# EasyEDA schematic GESTURE CAR.json

## Sheets
1 RECEIVING CIRCUIT: TITLE: RECEIVER CIRCUIT; REV: 1.0; Date: 11-03-2021; Sheet: 1/1
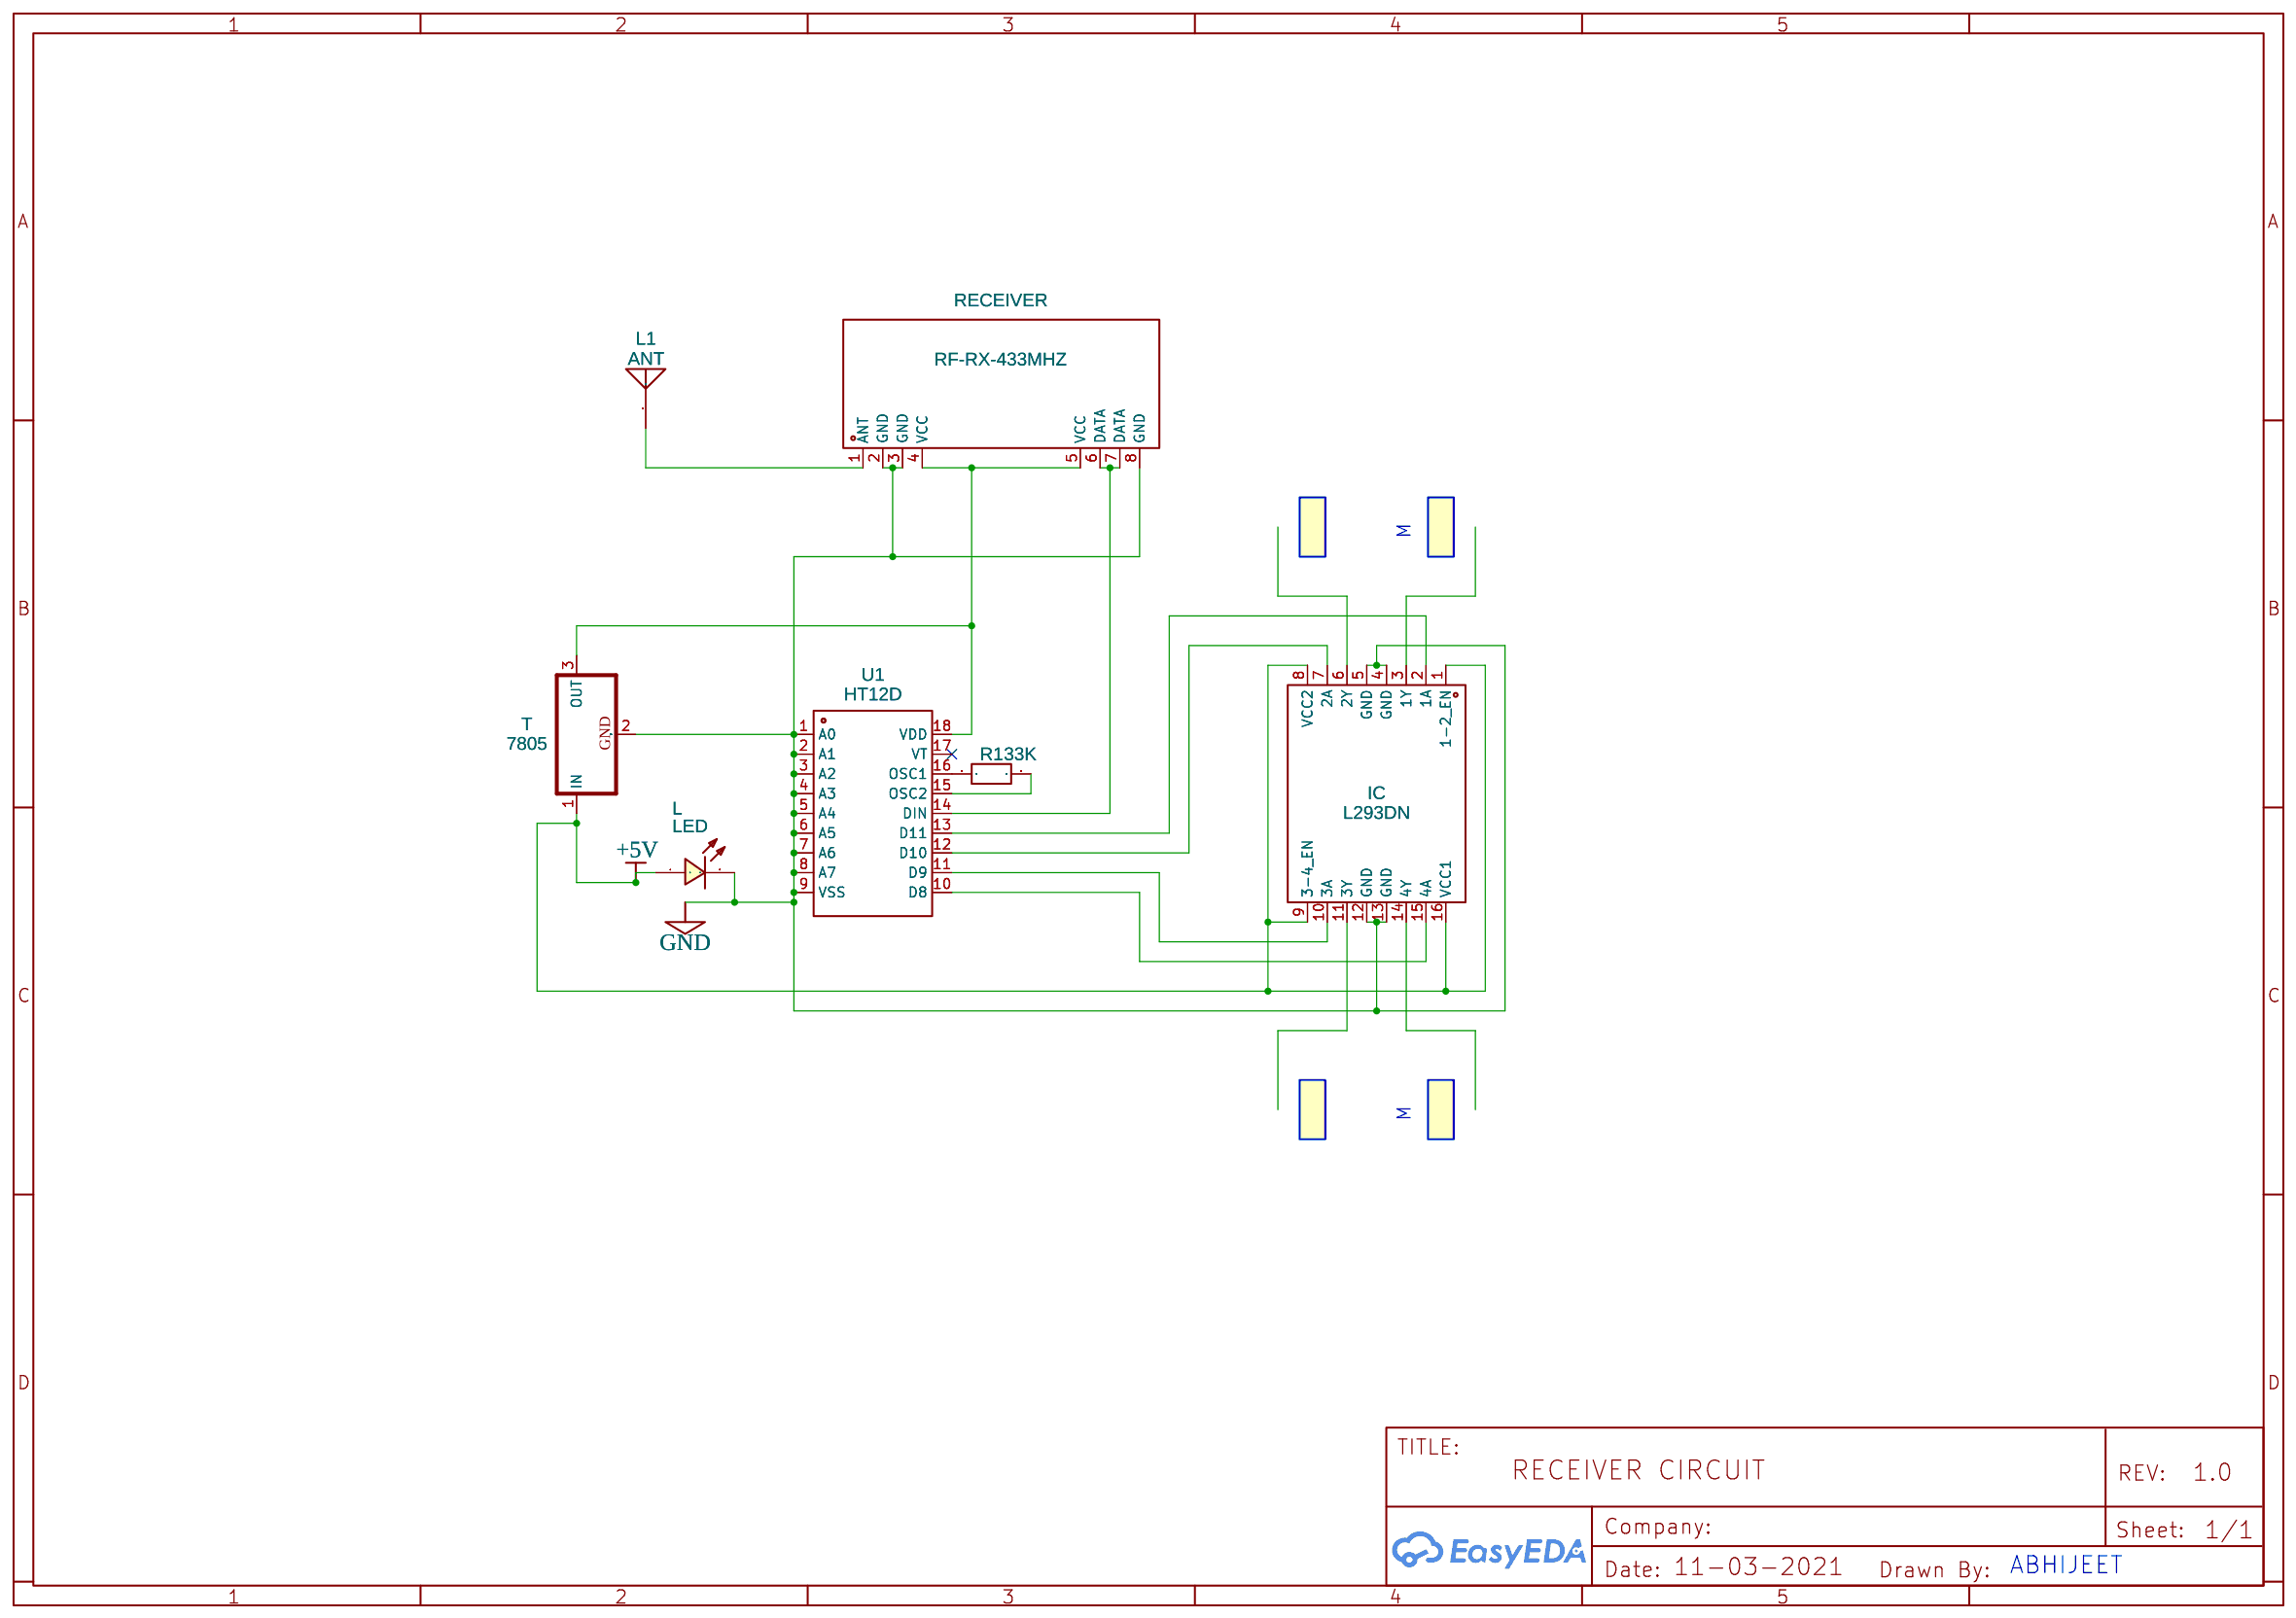
[diagram p0: RECEIVING CIRCUIT]
2 TRANSMITTER CIRCUIT: TITLE: TRANSMITTER CIRCUIT; Date: 27-03-2021
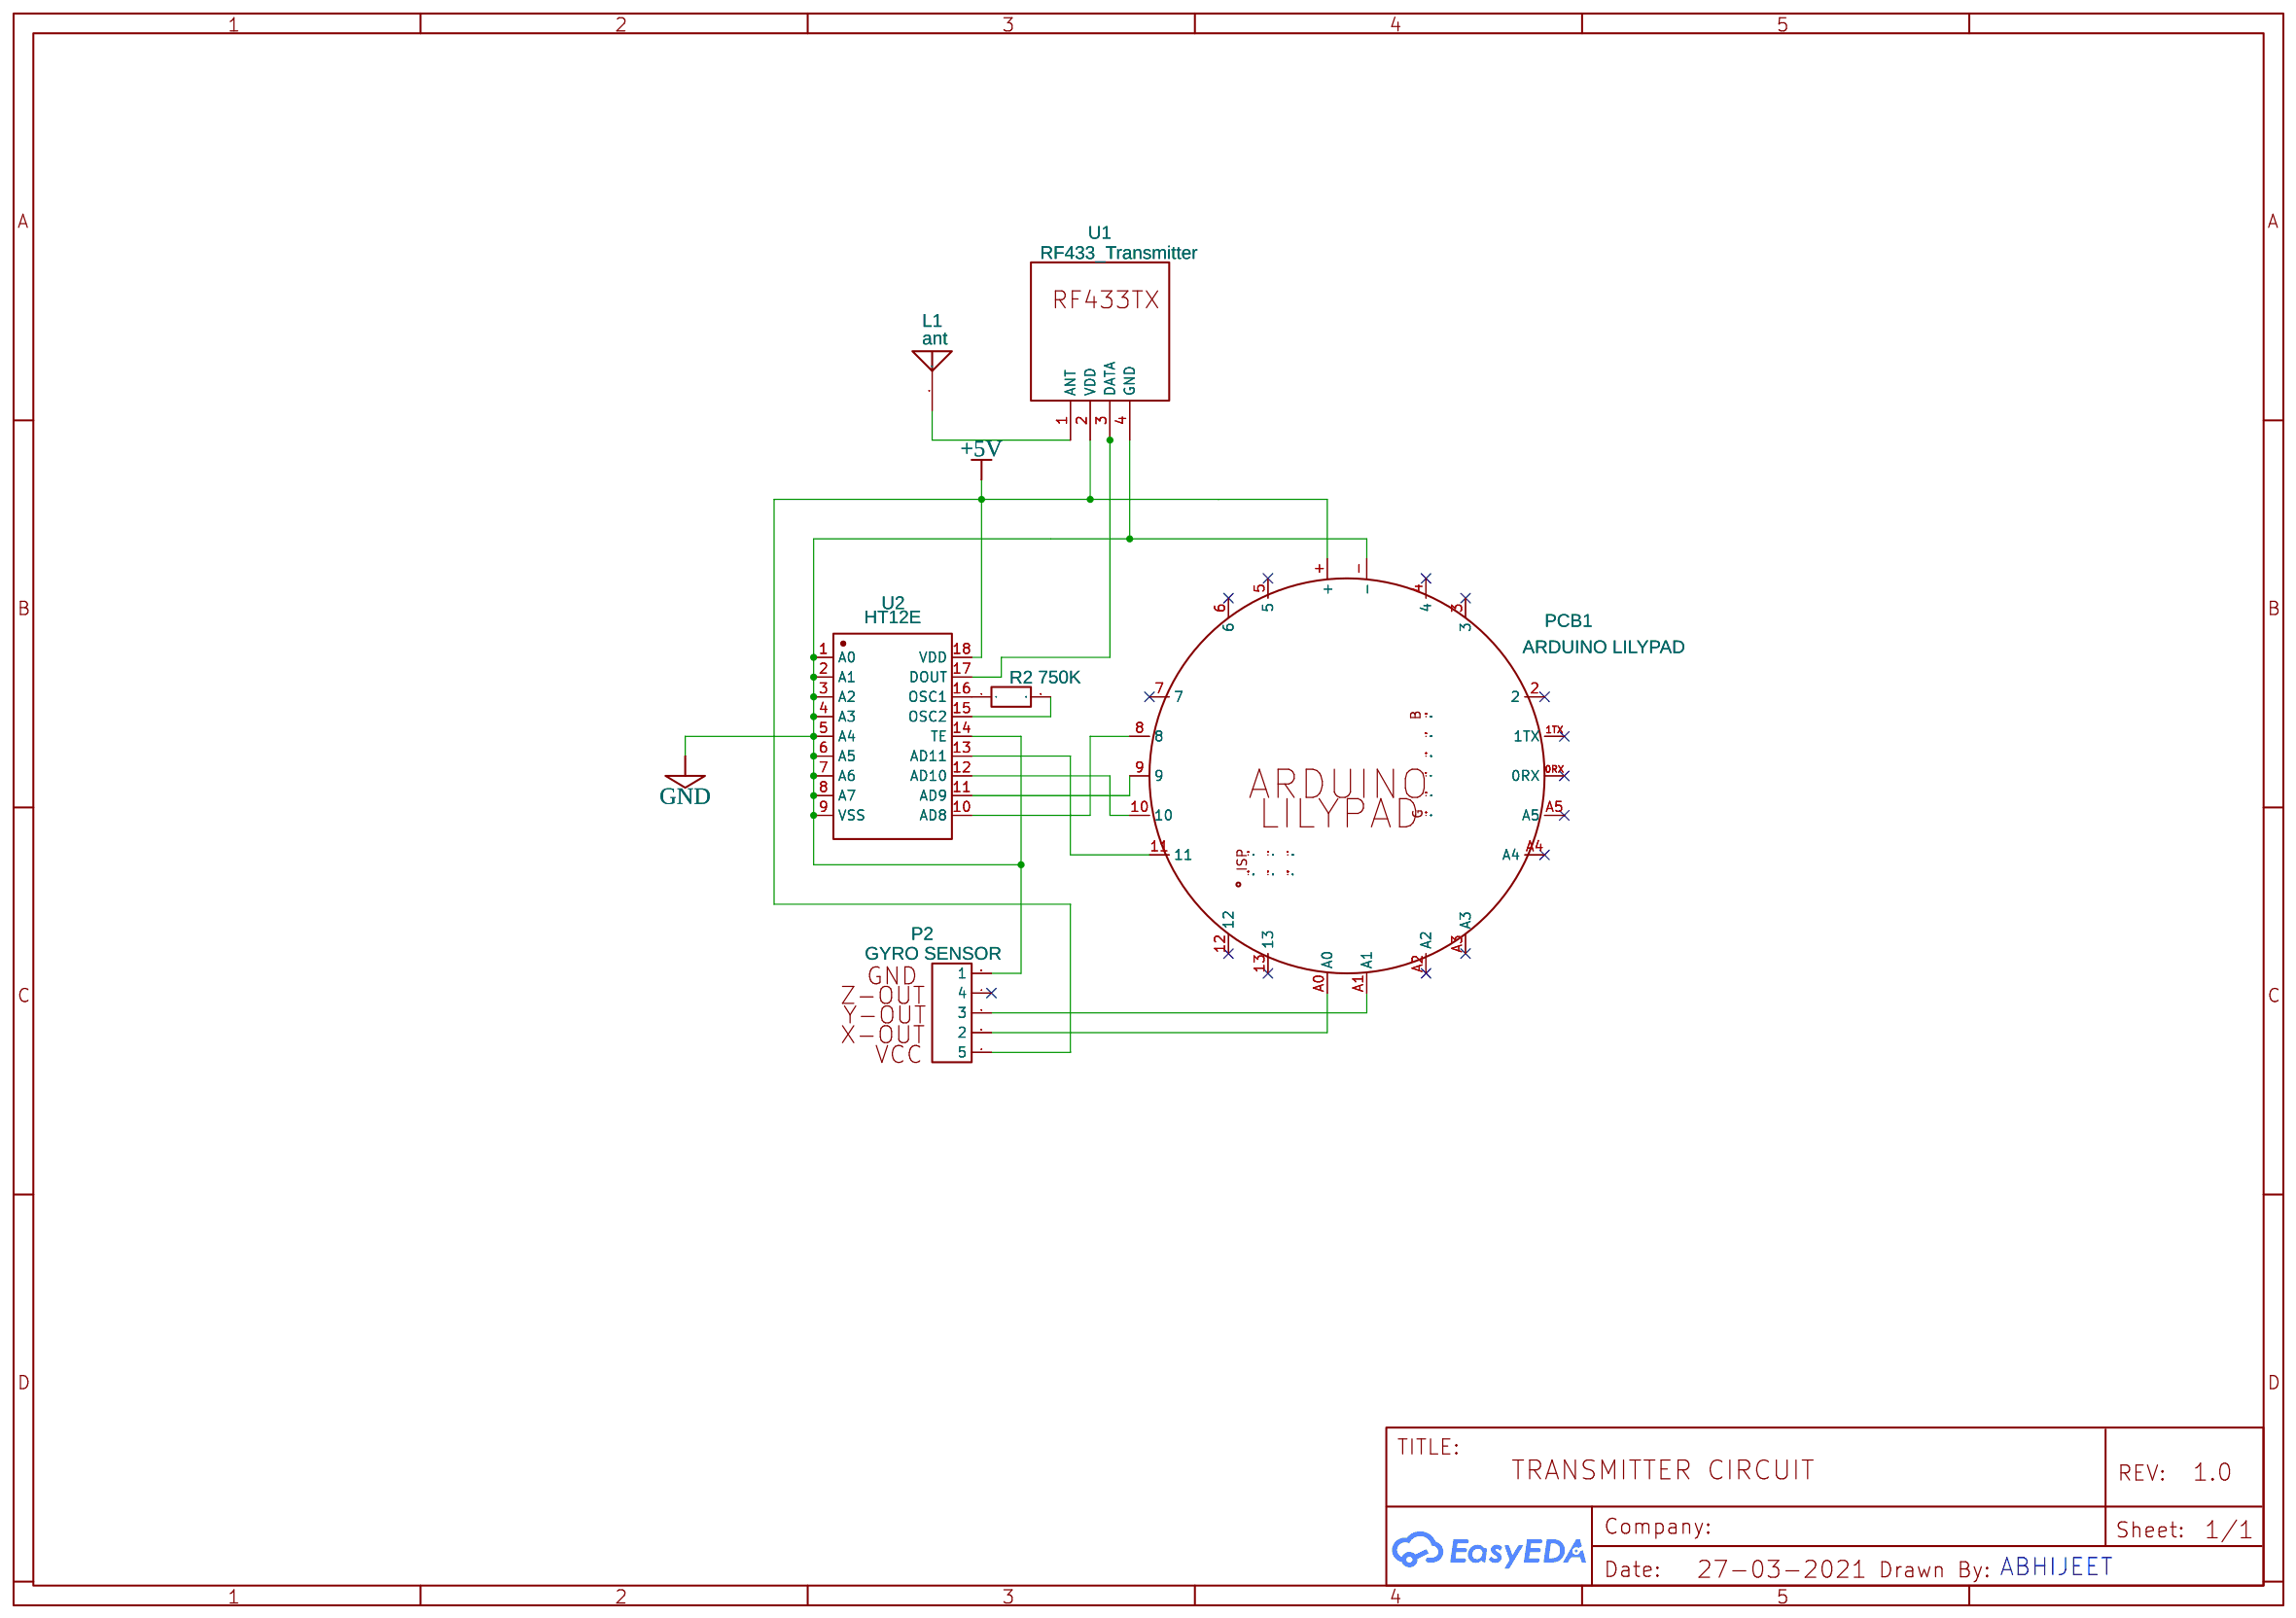
[diagram p1: TRANSMITTER CIRCUIT]

## Parts
sheet RECEIVING CIRCUIT
IC  L293DN  [DIP-16_L19.2-W6.6-P2.54-LS7.6-BL]
L  LED  [LED-TH_BD3.8-P2.54-FD]
L1  ANT  [ANT-TH_1P]
R1  33K  [RES-TH_BD2.4-L6.3-P10.30-D0.6]
RECEIVER  RF-RX-433MHZ  [WIRELM-TH_DL-RX98H-433M]
T  7805  [TO220H]
U1  HT12D  [DIP-18_L23.0-W6.5-P2.54-LS7.6-BL]
sheet TRANSMITTER CIRCUIT
L1#2  ant  [ANT-TH_1P]
P2  GYRO SENSOR  [HDR-5X1/2.54]
PCB1  ARDUINO LILYPAD  [ARDUINO_LILYPAD]
R2  750K  [RES-TH_BD2.4-L6.3-P10.30-D0.6]
U1#2  RF433_Transmitter  [RF_TRANSMITTER_433]
U2  HT12E  [DIP18]

## Library data of the parts
IC = L293DN: Supplier: LCSC; Supplier Part: C434590; Manufacturer: HGSEMI; Contributor: LCSC
L = LEDOrange orange 3AO4UD: Supplier: LCSC; Manufacturer: KENTO; image: //image.lceda.cn/szlcsc/C62095.jpg; Supplier Part: C62095
L1 L1#2 = TX433-TH-3: Supplier: LCSC; Supplier Part: C411375; Manufacturer: Chengdu Ebyte Elec Tech; Contributor: LCSC
R1 R2 = RN 1/4W 750K F T/B A1: Supplier: LCSC; Supplier Part: C410582; Manufacturer: TyoHM; Contributor: LCSC; LCSC Assembly: Yes; SMT Type: Extend; Paste Type: expand
RECEIVER = RF-RX-433MHZ: Supplier Part: C131030; Manufacturer: Generic; Manufacturer Part: RF Receiver 433MHz; Contributor: Theerthaprasad
T = 7805: Contributor: Adafruit; sourceId: UoUO6oGAS
U1 = HT12D: Supplier: LCSC; Manufacturer: HOLTEK; image: //image.lceda.cn/szlcsc/C14360.jpg; Supplier Part: C14360
P2 = GY-61 SENSOR: Supplier: Master; Manufacturer: BOOMELE; Manufacturer Part: GY-61; Supplier Part: C40877; Contributor: christhian
PCB1 = ARDUINO_LILYPAD: Device for representing a Lilypad Arduino board with a footprint in an EAGLE design. Created by Dave Young for Element14. More EAGLE documentation at: http:www.element14.comcommunitycommunityknodecadsoft_eagle
U1#2 = RF433_Transmitter: Contributor: msdevlopers
U2 = HT12E

## Nets
+5V: IC.1(1-2 EN) IC.8(VCC2) IC.9(3-4 EN) IC.16(VCC1) L.1(A) P2.1(5) PCB1.+ T.1(IN) U1#2.2(VDD) U2.18(VDD)
GND: IC.4(GND) IC.5(GND) IC.12(GND) IC.13(GND) L.2(K) P2.5(1) PCB1.- RECEIVER.2(GND) RECEIVER.3(GND) RECEIVER.8(GND) T.2(GND) U1.1(A0) U1.2(A1) U1.3(A2) U1.4(A3) U1.5(A4) U1.6(A5) U1.7(A6) U1.8(A7) U1.9(VSS) U1#2.4(GND) U2.1(A0) U2.2(A1) U2.3(A2) U2.4(A3) U2.5(A4) U2.6(A5) U2.7(A6) U2.8(A7) U2.9(VSS) U2.14(TE)
Net-(IC-2): IC.2(1A) U1.13(D11)
Net-(IC-7): IC.7(2A) U1.12(D10)
Net-(IC-10): IC.10(3A) U1.11(D9)
Net-(IC-15): IC.15(4A) U1.10(D8)
Net-(L1#2-1): L1#2.1 U1#2.1(ANT)
Net-(L1-1): L1.1 RECEIVER.1(ANT)
Net-(P2-2): P2.2 PCB1.A0
Net-(P2-3): P2.3 PCB1.A1
Net-(PCB1-8): PCB1.8 U2.10(AD8)
Net-(PCB1-9): PCB1.9 U2.11(AD9)
Net-(PCB1-10): PCB1.10 U2.12(AD10)
Net-(PCB1-11): PCB1.11 U2.13(AD11)
Net-(R1-1): R1.1 U1.16(OSC1)
Net-(R1-2): R1.2 U1.15(OSC2)
Net-(R2-1): R2.1 U2.16(OSC1)
Net-(R2-2): R2.2 U2.15(OSC2)
Net-(RECEIVER-4): RECEIVER.4(VCC) RECEIVER.5(VCC) T.3(OUT) U1.18(VDD)
Net-(RECEIVER-6): RECEIVER.6(DATA) RECEIVER.7(DATA) U1.14(DIN)
Net-(U1#2-3): U1#2.3(DATA) U2.17(DOUT)

Not connected (* = marked no-connect by the designer): IC 3(1Y) 6(2Y) 11(3Y) 14(4Y); P2 4*; PCB1 0RX* 1TX* 2* 3* 4* 5* 5V.(VCC) 6* 7* 12* 13* A2* A3* A4* A5* DTR GND. GND.. GND_(GND) MISO MOSI RESET..(RST) RXI SCK TXO VCC.; U1 17(VT)*

## Notes on the sheets
sheet 1
- M
- M
- ABHIJEET
sheet 2
- ABHIJEET
